# EAGLE board aqc-rev2 (EAGLE 8.3.1), part 1 of 2
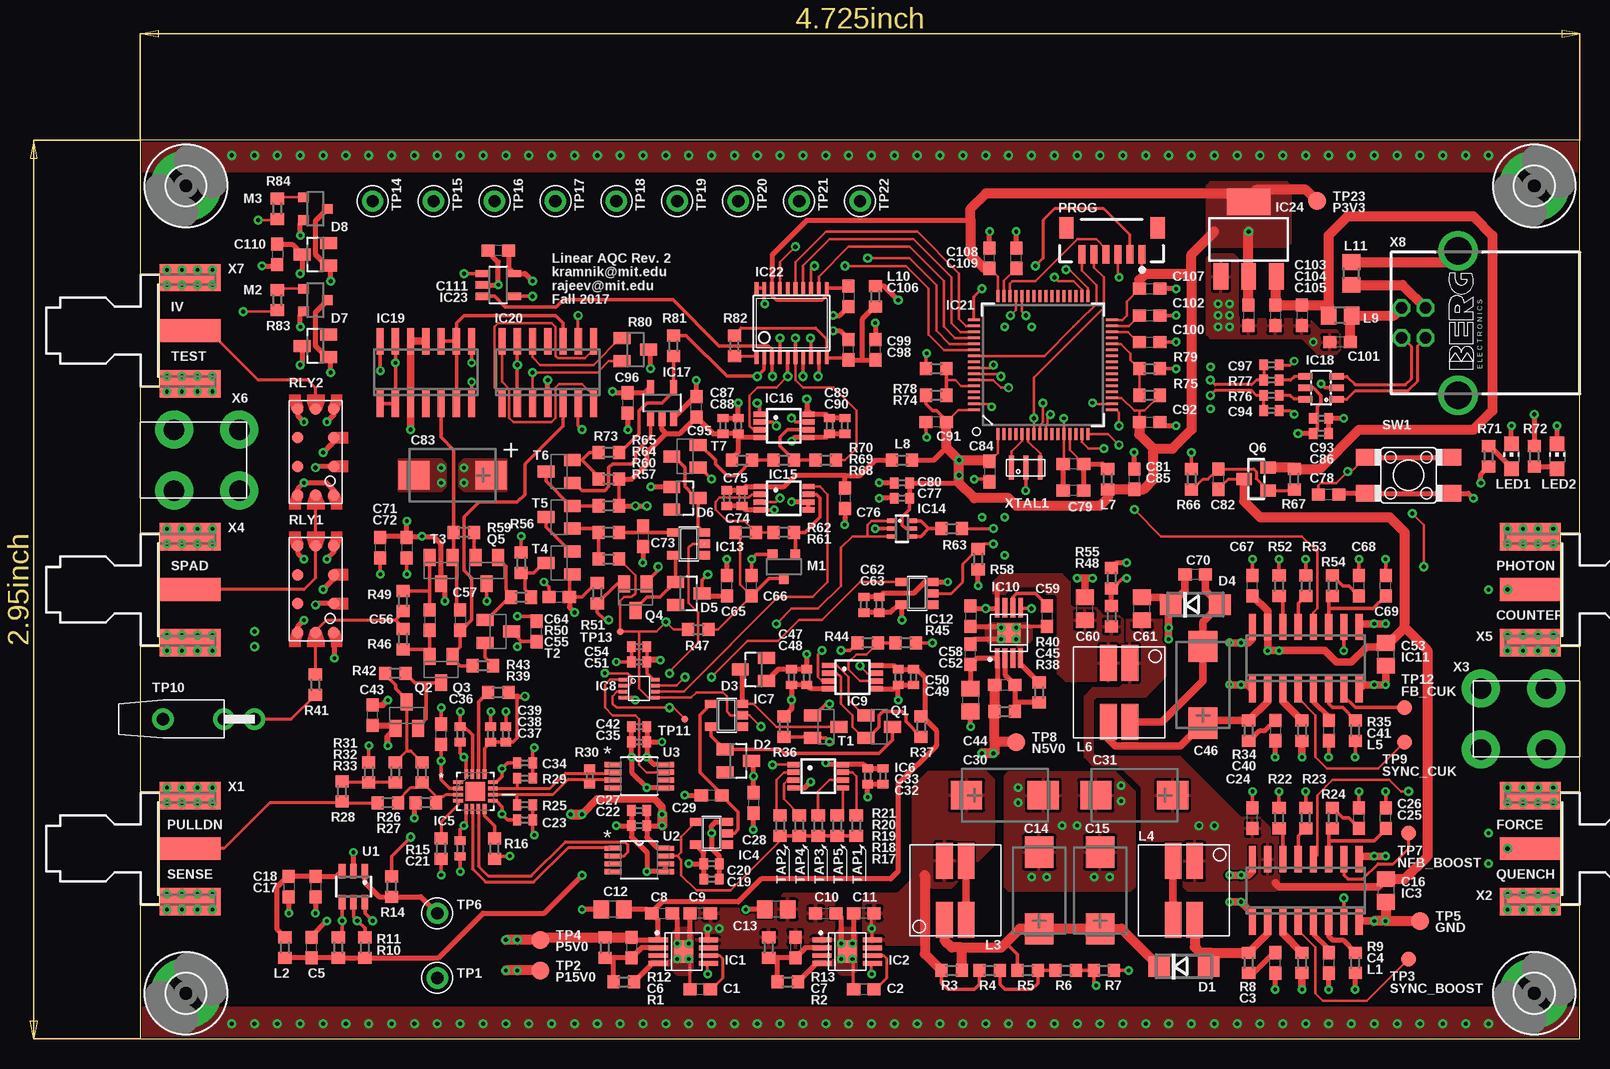
[diagram p12: board, top side]
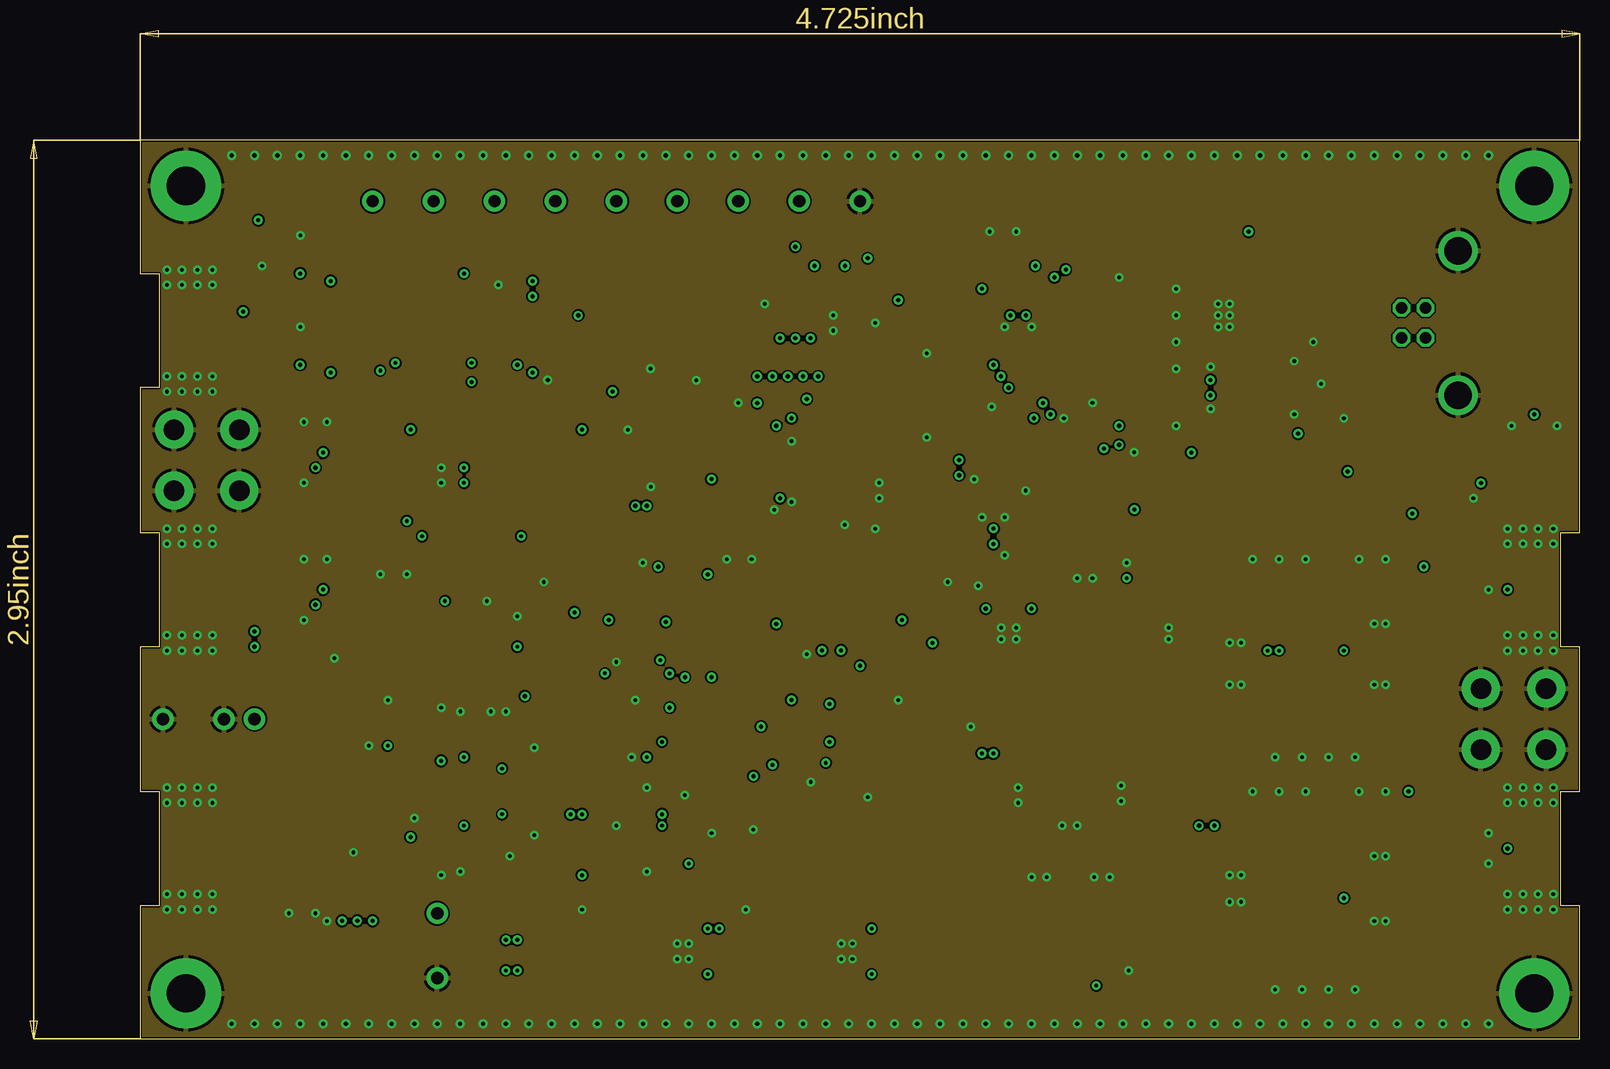
[diagram p13: board, inner layer Route2]
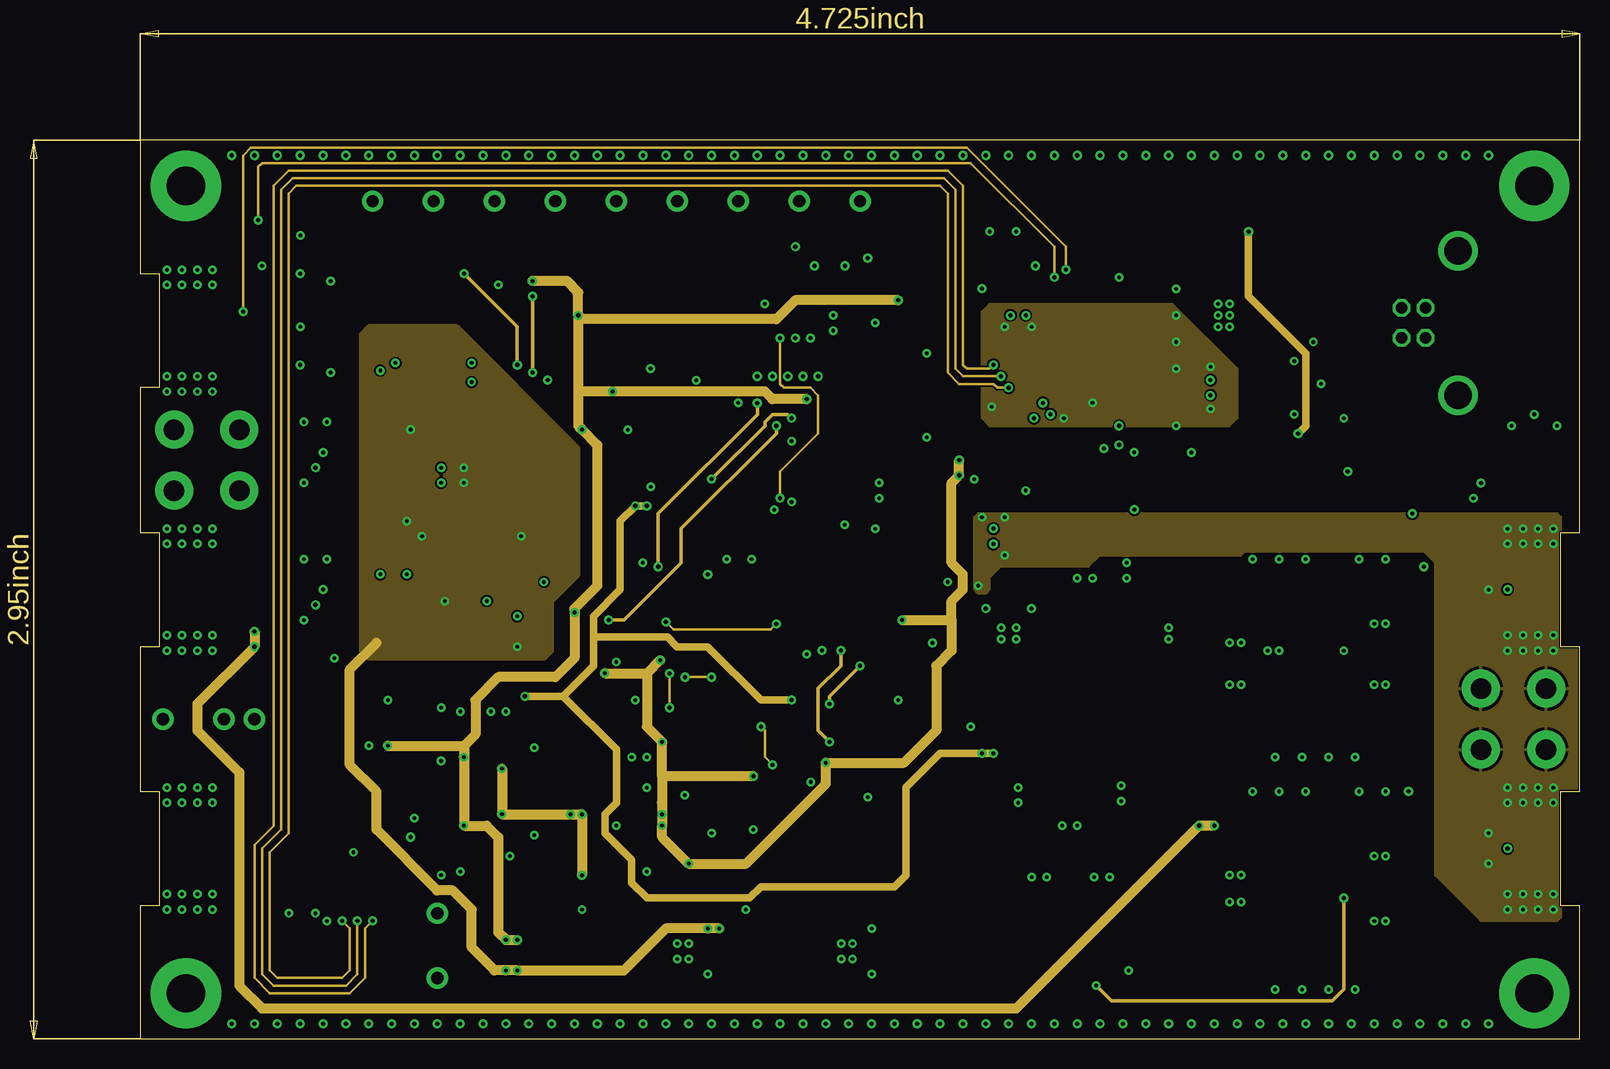
[diagram p14: board, inner layer Route15]
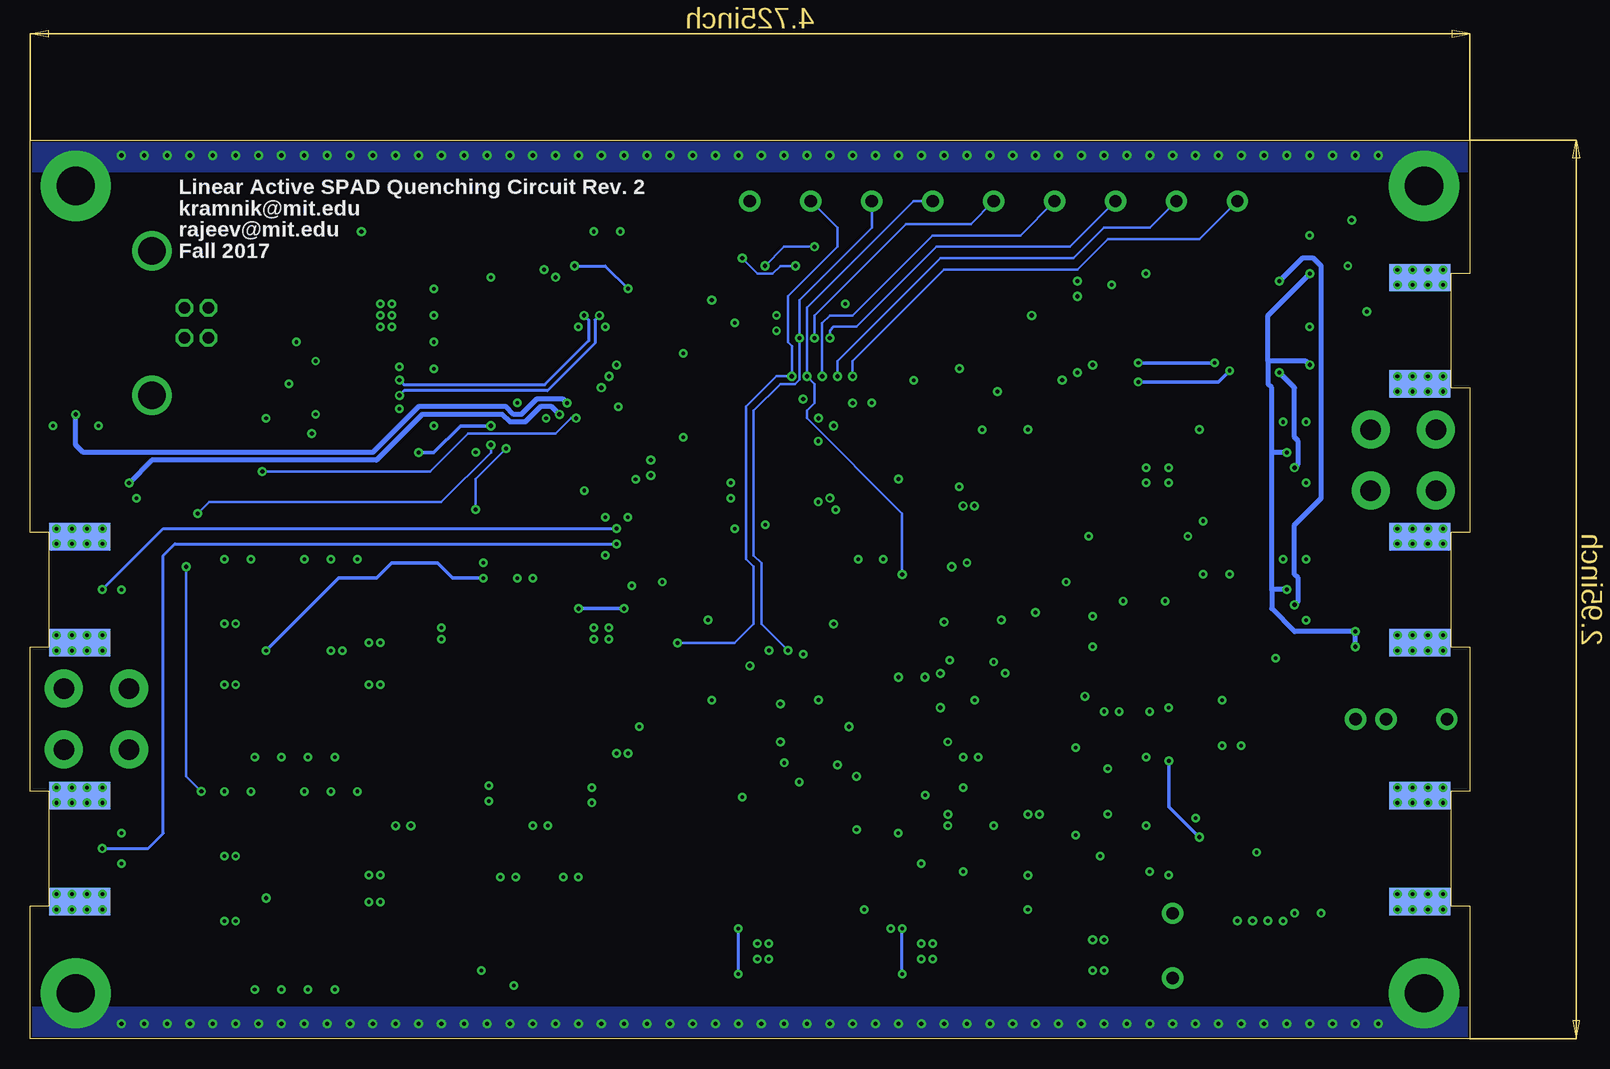
[diagram p15: board, bottom side, seen from below]

Size 120.02 x 74.93 mm. Coordinates in mm from the lower left corner, seen from the top.
Outline: 120.02,74.93 0,74.93 0,63.82 1.59,63.82 1.59,54.29 0,54.29 0,42.23 1.59,42.23 1.59,32.7 0,32.7 0,20.64 1.59,20.64 1.59,11.11 0,11.11 0,0 120.02,0 120.02,11.11 118.43,11.11 118.43,20.64 120.02,20.64 120.02,32.7 118.43,32.7 118.43,42.23 120.02,42.23 120.02,74.93
Copper layers (1+2*15+16): Top 0.035mm / dielectric 1.5mm / Route2 0.035mm / dielectric 0.15mm / Route15 0.035mm / dielectric 0.2mm / Bottom 0.035mm
Design rules "default *": minimum track width 8mil, minimum drill 0.3mm, track to track 6mil, track to pad 6mil, pad to pad 6mil, via to via 6mil, smd to smd 6mil, copper to edge 6mil, drill to drill 6mil, minimum pad ring 10mil, minimum via ring 8mil, stop-mask expansion 4mil, vias tented up to drill 25mil, thermal gap 10mil
Net classes: 1 100OHM_DIFF: width 0.254 mm, clearance 0.254 mm

## Footprints (pad centres in the part's own frame; a part is rotated, then mirrored left to right if it is on the bottom)
C0603 = smd 1.1 x 1: 1 -0.85,0; 2 0.85,0
C0805 = smd 1.3 x 1.5: 1 -0.95,0; 2 0.95,0
CT7343 = smd 2.6 x 2.4: + -3.2,0; - 3.2,0
C0402 = smd 0.7 x 0.9: 1 -0.65,0; 2 0.65,0
DO214AC = smd 1.8 x 1.7: A 2.05,0; C -2.05,0
SOT23 = smd 1 x 1.4: 1 -0.95,-1.1; 2 0.95,-1.1; 3 0,1.1
3,2-PAD = drill 3.2 pad 5.842: B3,2 0,0
MSOP-8_POWER_PAD = smd 0.4 x 1.6: 1 0,0; 2 0.65,0; 3 1.3,0; 4 1.95,0; 5 1.95,4.2; 6 1.3,4.2; 7 0.65,4.2; 8 0,4.2 | smd 1.89 x 1.57: PAD 0.975,2.1
SO16 = smd 0.6 x 2.2: 1 -4.445,-2.6; 2 -3.175,-2.6; 3 -1.905,-2.6; 4 -0.635,-2.6; 5 0.635,-2.6; 6 1.905,-2.6; 7 3.175,-2.6; 8 4.445,-2.6; 9 4.445,2.6; 10 3.175,2.6; 11 1.905,2.6; 12 0.635,2.6; 13 -0.635,2.6; 14 -1.905,2.6; 15 -3.175,2.6; 16 -4.445,2.6
SOT23-5 = smd 0.69 x 0.99: 1 -0.95,-1.29; 2 0,-1.29; 3 0.95,-1.29; 4 0.95,1.3; 5 -0.95,1.3
QFN50P300X300X80-16N = smd 0.813 x 0.305: 1 -1.448,0.762; 2 -1.448,0.254; 3 -1.448,-0.254; 4 -1.448,-0.762; 9 1.448,-0.762; 10 1.448,-0.254; 11 1.448,0.254; 12 1.448,0.762 | smd 0.305 x 0.813: 5 -0.762,-1.448; 6 -0.254,-1.448; 7 0.254,-1.448; 8 0.762,-1.448; 13 0.762,1.448; 14 0.254,1.448; 15 -0.254,1.448; 16 -0.762,1.448 | smd 1.6 x 1.6: 17 0,0
MSOP8 = smd 0.45 x 1: 1 -0.975,-2.05; 2 -0.325,-2.05; 3 0.325,-2.05; 4 0.975,-2.05; 5 0.975,2.05; 6 0.325,2.05; 7 -0.325,2.05; 8 -0.975,2.05
US8_3.1MM_JDEC_MO-187 = smd 0.3 x 0.7: 1 -0.75,-1.35; 2 -0.25,-1.35; 3 0.25,-1.35; 4 0.75,-1.35; 5 0.75,1.35; 6 0.25,1.35; 7 -0.25,1.35; 8 -0.75,1.35
SC70-6L = smd 0.35 x 0.8: 1 -0.65,-0.85; 2 0,-0.85; 3 0.65,-0.85; 4 0.65,0.85; 5 0,0.85; 6 -0.65,0.85
SOT23-5' = smd 0.6 x 1.2: 1 -0.95,-1.306; 2 0,-1.306; 3 0.95,-1.306; 4 0.95,1.306; 5 -0.95,1.306
SOT23-6L = smd 0.55 x 1.2: 1 -0.95,-1.3; 2 0,-1.3; 3 0.95,-1.3; 4 0.95,1.3; 5 0,1.3; 6 -0.95,1.3
SO14 = smd 0.6 x 2.2: 1 -3.81,-2.6; 2 -2.54,-2.6; 3 -1.27,-2.6; 4 0,-2.6; 5 1.27,-2.6; 6 2.54,-2.6; 7 3.81,-2.6; 8 3.81,2.6; 9 2.54,2.6; 10 1.27,2.6; 11 0,2.6; 12 -1.27,2.6; 13 -2.54,2.6; 14 -3.81,2.6
TQFP64_STM32 = smd 0.22 x 1: 1 -3.75,-5.75; 2 -3.25,-5.75; 3 -2.75,-5.75; 4 -2.25,-5.75; 5 -1.75,-5.75; 6 -1.25,-5.75; 7 -0.75,-5.75; 8 -0.25,-5.75; 9 0.25,-5.75; 10 0.75,-5.75; 11 1.25,-5.75; 12 1.75,-5.75; 13 2.25,-5.75; 14 2.75,-5.75; 15 3.25,-5.75; 16 3.75,-5.75; 33 3.75,5.75; 34 3.25,5.75; 35 2.75,5.75; 36 2.25,5.75; 37 1.75,5.75; 38 1.25,5.75; 39 0.75,5.75; 40 0.25,5.75; 41 -0.25,5.75; 42 -0.75,5.75; 43 -1.25,5.75; 44 -1.75,5.75; 45 -2.25,5.75; 46 -2.75,5.75; 47 -3.25,5.75; 48 -3.75,5.75 | smd 1 x 0.22: 17 5.75,-3.75; 18 5.75,-3.25; 19 5.75,-2.75; 20 5.75,-2.25; 21 5.75,-1.75; 22 5.75,-1.25; 23 5.75,-0.75; 24 5.75,-0.25; 25 5.75,0.25; 26 5.75,0.75; 27 5.75,1.25; 28 5.75,1.75; 29 5.75,2.25; 30 5.75,2.75; 31 5.75,3.25; 32 5.75,3.75; 49 -5.75,3.75; 50 -5.75,3.25; 51 -5.75,2.75; 52 -5.75,2.25; 53 -5.75,1.75; 54 -5.75,1.25; 55 -5.75,0.75; 56 -5.75,0.25; 57 -5.75,-0.25; 58 -5.75,-0.75; 59 -5.75,-1.25; 60 -5.75,-1.75; 61 -5.75,-2.25; 62 -5.75,-2.75; 63 -5.75,-3.25; 64 -5.75,-3.75
TSSOP20 = smd 0.305 x 0.991: 1 -2.925,-2.918; 2 -2.275,-2.918; 3 -1.625,-2.918; 4 -0.975,-2.918; 5 -0.325,-2.918; 6 0.325,-2.918; 7 0.975,-2.918; 8 1.625,-2.918; 9 2.275,-2.918; 10 2.925,-2.918; 11 2.925,2.918; 12 2.275,2.918; 13 1.625,2.918; 14 0.975,2.918; 15 0.325,2.918; 16 -0.325,2.918; 17 -0.975,2.918; 18 -1.625,2.918; 19 -2.275,2.918; 20 -2.925,2.918
SOT-223 = smd 1.219 x 2.235: 1 -2.311,-3.099; 2 0,-3.099; 3 2.311,-3.099 | smd 3.6 x 2.2: 4 0,3.099
R0603 = smd 1 x 1.1: 1 -0.85,0; 2 0.85,0
SRF0703 = smd 1.4 x 3: 1 0.9,2.45; 2 -0.9,2.45; 3 -0.9,-2.45; 4 0.9,-2.45
R0805 = smd 1.3 x 1.5: 1 -0.95,0; 2 0.95,0
CHIP-LED0805 = smd 1.2 x 1.2: A 0,-1.05; C 0,1.05
SOT23R_INFINEON = smd 0.8 x 0.9: 1 -0.95,-1; 2 0.95,-1; 3 0,1
JST-6-SMD-VERT-1.0MM = smd 0.6 x 1.55: 1 -2.54,1.27; 2 -1.54,1.27; 3 -0.54,1.27; 4 0.46,1.27; 5 1.46,1.27; 6 2.46,1.27 | smd 1.2 x 1.8: P$1 -3.84,-0.955; P$2 3.76,-0.955
SOT23-BEC = smd 1 x 1.4: B -0.95,-1.1; C 0,1.1; E 0.95,-1.1
SOT23-WIDE = smd 1 x 1.27: 1 -0.95,-1; 2 0.95,-1; 3 0,1
R0402 = smd 0.7 x 0.9: 1 -0.65,0; 2 0.65,0
SOT23C = smd 1 x 1.4: 1 -0.95,-1.1; 2 0.95,-1.1; 3 0,1.1
MEDER_RELAY_CRF = smd 0.95 x 0.95: 1 1.2,0.7; 2 3.6,0.7; 3 6,0.7; 4 8.4,0.7; 5 8.4,2.2; 6 8.4,3.7; 7 6,3.7; 8 3.6,3.7; 9 1.2,3.7; 10 1.2,2.2
E-SWITCH-TL3305AF160QG = smd 1.6 x 1.4: 1 -3.6,-1.5; 2 3.6,-1.5; 3 -3.6,1.5; 4 3.6,1.5
KEYSTONE_5000_MINIATURE = drill 1.016 pad 1.778: P$1 0,0
TP15R = smd 1.5 x 1.5: TP 0,0
B1,27 = smd 1.27 x 1.27: TP 0,0
JOHNSON-129-0701-30X = drill 1.041 pad 1.778: GND1 2.54,0; GND2 7.62,0; SIG 0,0
TP06R = smd 0.6 x 0.6: TP 0,0
SOT23-6 = smd 0.55 x 1.2: 1 -0.95,-1.3; 2 0,-1.3; 3 0.95,-1.3; 4 0.95,1.3; 5 0,1.3; 6 -0.95,1.3
SOP65P490X110-8N = smd 1.422 x 0.432: 1 -2.184,0.965; 2 -2.184,0.33; 3 -2.184,-0.33; 4 -2.184,-0.965; 5 2.184,-0.965; 6 2.184,-0.33; 7 2.184,0.33; 8 2.184,0.965
J502-ND-142-0711-871/876 = smd 5.08 x 1.905: 1 2.565,0 | smd 5.08 x 2.286: G@1 2.565,4.42; G@2 2.565,-4.42 | smd 5.08 x 2.286 bottom: G@3 2.565,4.42; G@4 2.565,-4.42
KEYSTONE-7774 = drill 1.702 pad 3.175: 1 2.819,-2.54; 2 8.255,-2.54; 3 8.255,2.54; 4 2.819,2.54
PN61729-S = drill 0.95 octagon: 1 1.25,4.71; 2 -1.25,4.71; 3 -1.25,2.71; 4 1.25,2.71 | drill 2.3 pad 2.9: S1 -6.02,0; S2 6.02,0
CSTCE_G15L/CSTCE_GH5L = smd 0.4 x 2: 1 -1.2,0; 2 0,0; 3 1.2,0

## Placement (x,y rotation side)
C1  10n  [C0603]  46.67,4.13 180 top
C2  10n  [C0603]  60.33,4.13 180 top
C3  1n  [C0603]  94.61,6.35 90 top
C4  1300p  [C0603]  99.06,6.35 270 top
C5  100n  [C0603]  14.29,7.62 90 top
C6  10n  [C0603]  40.96,7.62 270 top
C7  10n  [C0603]  54.61,7.62 270 top
C8  100n  [C0603]  43.5,10.48 0 top
C9  100n  [C0603]  46.67,10.48 180 top
C10  100n  [C0603]  57.15,10.48 0 top
C11  100n  [C0603]  60.33,10.48 180 top
C12  10u  [C0805]  39.37,10.79 180 top
C13  10u  [C0805]  53.02,10.79 180 top
C14  47u, 20V  [CT7343]  74.93,12.38 90 top
C15  47u, 20V  [CT7343]  80.01,12.38 90 top
C16  4u7  [C0805]  103.82,12.38 270 top
C17  4u7  [C0603]  12.38,12.7 270 top
C18  100n  [C0603]  14.61,12.7 270 top
C19  100n  [C0402]  47.62,13.34 0 top
C20  10n  [C0402]  47.62,14.61 0 top
C21  10n  [C0402]  26.67,15.88 270 top
C22  10n  [C0402]  41.59,17.78 180 top
C23  10n  [C0402]  32.07,18.26 0 top
C24  100n  [C0603]  92.71,18.41 90 top
C25  15n  [C0603]  101.6,18.41 90 top
C26  220p  [C0603]  103.82,18.41 90 top
C27  100n  [C0402]  41.59,19.05 180 top
C28  470p  [C0603]  51.12,19.68 270 top
C29  10p  [C0603]  47.62,20.32 180 top
C30  47u, 20V  [CT7343]  72.07,20.32 0 top
C31  47u, 20V  [CT7343]  82.87,20.32 180 top
C32  100n  [C0402]  60.64,21.91 270 top
C33  10n  [C0402]  61.91,21.91 270 top
C34  100n  [C0402]  32.07,23.02 0 top
C35  100n  [C0402]  41.59,24.77 180 top
C36  1n  [C0603]  25.08,25.4 90 top
C37  100n  [C0402]  26.67,25.4 90 top
C38  100n  [C0402]  29.21,25.4 90 top
C39  10n  [C0402]  30.48,25.4 90 top
C40  10n  [C0603]  94.61,25.72 270 top
C41  1300p  [C0603]  99.06,25.72 270 top
C42  10n  [C0402]  41.59,26.04 180 top
C43  100n  [C0603]  19.37,26.99 90 top
C44  10u  [C0805]  69.22,28.26 270 top
C45  10n  [C0603]  72.07,29.53 0 top
C46  68u, 16V  [CT7343]  88.58,29.53 90 top
C47  10n  [C0402]  54.29,30.16 90 top
C48  100n  [C0402]  55.56,30.16 90 top
C49  10n  [C0402]  63.18,30.16 270 top
C50  100n  [C0402]  64.45,30.16 270 top
C51  10n  [C0402]  41.59,31.43 180 top
C52  100n  [C0603]  69.22,32.07 90 top
C53  4u7  [C0805]  103.82,32.07 270 top
C54  100n  [C0402]  41.59,32.7 180 top
C55  100n  [C0603]  33.02,33.97 90 top
C56  10n  [C0603]  24.13,34.92 270 top
C57  10n  [C0603]  26.67,34.92 270 top
C58  100n  [C0603]  69.22,35.24 270 top
C59  10n  [C0603]  75.56,35.24 270 top
C60  10u, 10V  [C0805]  78.74,35.88 90 top
C61  4u7  [C0805]  83.5,35.88 90 top
C62  10n  [C0402]  60.33,36.2 90 top
C63  100n  [C0402]  61.59,36.2 90 top
C64  100n  [C0603]  34.92,36.83 180 top
C65  470p  [C0603]  48.9,37.78 90 top
C66  470p  [C0603]  50.96,37.78 90 top
C67  100n  [C0603]  92.71,37.78 90 top
C68  33n  [C0603]  101.6,37.78 90 top
C69  DNP  [C0603]  103.82,37.78 90 top
C70  DNP  [C0603]  87.95,38.73 180 top
C71  100n  [C0603]  20,40.96 270 top
C72  10n  [C0603]  22.23,40.96 270 top
C73  10p  [C0603]  41.91,41.91 270 top
C74  10n  [C0402]  48.9,45.09 270 top
C75  100n  [C0402]  50.16,45.09 270 top
C76  4u7  [C0603]  58.74,45.09 270 top
C77  10n  [C0402]  63.5,45.09 180 top
C78  10n  [C0603]  99.06,45.4 0 top
C79  4u7  [C0603]  77.79,45.72 180 top
C80  100n  [C0402]  63.5,46.35 180 top
C81  4u7  [C0603]  82.87,46.67 90 top
C82  100n  [C0603]  89.85,46.67 270 top
C83  47u, 20V  [CT7343]  26.04,46.99 180 top
C84  100n  [C0603]  70.8,47.31 270 top
C85  100n  [C0603]  77.79,47.94 180 top
C86  100n  [C0402]  98.42,50.48 0 top
C87  100n  [C0402]  48.58,51.12 90 top
C88  10n  [C0402]  49.85,51.12 90 top
C89  100n  [C0402]  57.47,51.12 270 top
C90  10n  [C0402]  58.74,51.12 270 top
C91  100n  [C0603]  66.36,51.44 180 top
C92  100n  [C0603]  84.14,51.44 0 top
C93  10n  [C0402]  98.42,51.75 0 top
C94  47p  [C0402]  94.3,52.39 0 top
C95  100n  [C0603]  46.35,52.7 90 top
C96  100n  [C0603]  40.64,53.02 270 top
C97  47p  [C0402]  94.3,56.2 0 top
C98  100n  [C0603]  59.05,57.47 90 top
C99  4u7  [C0603]  61.28,57.47 90 top
C100  100n  [C0603]  84.14,58.1 0 top
C101  10n  [C0603]  100.01,58.1 180 top
C102  100n  [C0603]  84.14,60.33 0 top
C103  100n  [C0603]  92.39,60.33 270 top
C104  100n  [C0603]  94.61,60.33 270 top
C105  4u7  [C0603]  96.84,60.33 270 top
C106  100n  [C0603]  59.05,61.91 270 top
C107  100n  [C0603]  84.14,62.55 0 top
C108  100n  [C0603]  70.8,65.09 90 top
C109  100n  [C0603]  73.03,65.09 90 top
C110  100n  [C0603]  11.43,65.41 270 top
C111  100n  [C0603]  29.84,65.72 180 top
D1  CDBA140SL-HF  [DO214AC]  87,6.03 0 top
D2  BAS40  [SOT23]  49.85,23.18 270 top
D3  BAS40  [SOT23]  51.12,30.8 90 top
D4  CDBA140SL-HF  [DO214AC]  87.95,36.2 0 top
D5  BAS40  [SOT23]  45.72,37.15 270 top
D6  BAS40  [SOT23]  45.4,45.09 270 top
D7  BAS40  [SOT23]  14.61,57.78 90 top
D8  BAS40  [SOT23]  14.61,65.41 90 top
H1  MOUNT-PAD-ROUND3.2  [3,2-PAD]  3.81,3.81 0 top
H2  MOUNT-PAD-ROUND3.2  [3,2-PAD]  116.2,3.81 0 top
H3  MOUNT-PAD-ROUND3.2  [3,2-PAD]  3.81,71.12 0 top
H4  MOUNT-PAD-ROUND3.2  [3,2-PAD]  116.2,71.12 0 top
IC1  TPS7A4901  [MSOP-8_POWER_PAD]  43.18,8.26 270 top
IC2  TPS7A4901  [MSOP-8_POWER_PAD]  56.83,8.26 270 top
IC3  LT1534-1  [SO16]  97.16,12.38 0 top
IC4  74AHC1G04DBV  [SOT23-5]  47.62,17.14 90 top
IC5  ADCMP582  [QFN50P300X300X80-16N]  27.94,20.64 0 top
IC6  DS1100LU-20+  [MSOP8]  56.52,21.91 270 top
IC7  74AHC1G04DBV  [SOT23-5]  48.9,26.99 90 top
IC8  NC7SV74K8X  [US8_3.1MM_JDEC_MO-187]  41.59,29.21 270 top
IC9  TLV272DGK  [MSOP8]  59.37,30.16 270 top
IC10  TPS7A3001  [MSOP-8_POWER_PAD]  71.44,31.75 0 top
IC11  LT1534-1  [SO16]  97.16,31.75 0 top
IC12  74AHC1G04DBV  [SOT23-5]  64.77,37.15 90 top
IC13  74AHC1G04DBV  [SOT23-5]  45.72,41.27 90 top
IC14  NC7WZ16P6X  [SC70-6L]  63.5,42.55 270 top
IC15  LTC1711  [MSOP8]  53.66,45.09 270 top
IC16  TLV272DGK  [MSOP8]  53.66,51.12 270 top
IC17  TLV271DBV  [SOT23-5']  43.5,53.02 0 top
IC18  USBLC6-2SC6Y  [SOT23-6L]  98.42,54.29 90 top
IC19  ALD1107  [SO14]  23.81,55.56 0 top
IC20  ALD1106  [SO14]  33.97,55.56 0 top
IC21  STM32F411RE  [TQFP64_STM32]  75.25,56.2 0 top
IC22  MAX572X  [TSSOP20]  54.29,59.69 0 top
IC23  TLV271DBV  [SOT23-5']  29.84,62.87 270 top
IC24  LM1117  [SOT-223]  92.39,66.67 0 top
L1  25n  [R0603]  96.84,6.35 270 top
L2  PE-0603FB601ST  [R0603]  12.06,7.62 90 top
L3  SRF0703-820M  [SRF0703]  67.94,12.38 180 top
L4  SRF0703-820M  [SRF0703]  87,12.38 0 top
L5  25n  [R0603]  96.84,25.72 270 top
L6  SRF0703-820M  [SRF0703]  81.6,28.89 0 top
L7  PE-0603FB601ST  [R0603]  80.64,46.67 90 top
L8  PE-0603FB601ST  [R0603]  63.5,48.26 180 top
L9  MI0805J102R-10  [R0805]  100.01,60.33 180 top
L10  PE-0603FB601ST  [R0603]  61.28,61.91 270 top
L11  MI0805J102R-10  [R0805]  100.97,63.82 90 top
LED1  [CHIP-LED0805]  114.3,48.58 0 top
LED2  [CHIP-LED0805]  118.11,48.58 0 top
M1  BSS806N  [SOT23R_INFINEON]  53.66,39.37 180 top
M2  BSS806N  [SOT23R_INFINEON]  14.61,61.59 270 top
M3  BSS806N  [SOT23R_INFINEON]  14.61,69.22 270 top
PROG  JST_VERT  [JST-6-SMD-VERT-1.0MM]  80.96,66.67 180 top
Q1  MMBTH81  [SOT23-BEC]  61.59,26.04 270 top
Q2  MMBTH81  [SOT23-BEC]  22.23,26.99 0 top
Q3  MMBTH81  [SOT23-BEC]  25.08,30.8 180 top
Q4  MMBTH81  [SOT23-BEC]  41.27,36.83 180 top
Q5  MMBTH81  [SOT23-BEC]  28.89,39.05 180 top
Q6  IRLML6402TRPBF  [SOT23-WIDE]  93.03,46.67 90 top
R1  24k  [R0603]  40.32,4.76 0 top
R2  11k8  [R0603]  53.98,4.76 0 top
R3  DNP  [R0603]  67.63,5.71 180 top
R4  0R  [R0603]  70.8,5.71 0 top
R5  DNP  [R0603]  73.98,5.71 0 top
R6  29k4  [R0603]  77.15,5.71 180 top
R7  2k49  [R0603]  80.33,5.71 0 top
R8  10R  [R0603]  92.39,6.35 270 top
R9  16k9  [R0603]  101.28,6.35 90 top
R10  2k2  [R0603]  16.51,7.62 90 top
R11  2k2  [R0603]  18.73,7.62 90 top
R12  76k8  [R0603]  38.73,7.62 90 top
R13  137k  [R0603]  52.39,7.62 90 top
R14  100R  [R0603]  20.95,12.7 270 top
R15  DNP  [R0603]  25.08,15.88 90 top
R16  49R9  [R0603]  29.53,15.88 270 top
R17  DNP  [R0603]  53.34,17.78 90 top
R18  DNP  [R0603]  54.93,17.78 90 top
R19  DNP  [R0603]  56.52,17.78 90 top
R20  DNP  [R0603]  58.1,17.78 90 top
R21  DNP  [R0603]  59.69,17.78 90 top
R22  1k  [R0603]  94.93,18.41 90 top
R23  1k  [R0603]  97.16,18.41 90 top
R24  6k8  [R0603]  99.38,18.41 270 top
R25  150R  [R0402]  32.07,19.53 0 top
R26  DNP  [R0603]  20.64,19.68 0 top
R27  DNP  [R0603]  23.81,19.68 0 top
R28  0R  [R0603]  16.83,20.64 90 top
R29  150R  [R0402]  32.07,21.75 0 top
R30  100R  [R0402]  37.47,21.91 90 top
R31  DNP  [R0603]  19.05,22.23 270 top
R32  1k  [R0603]  21.27,22.23 90 top
R33  0R  [R0603]  23.5,22.23 90 top
R34  100R  [R0603]  92.39,25.72 270 top
R35  16k9  [R0603]  101.28,25.72 90 top
R36  470R  [R0603]  53.66,26.04 270 top
R37  470R  [R0603]  65.09,26.04 90 top
R38  76k8  [R0603]  72.07,27.3 180 top
R39  10k  [R0603]  29.84,28.89 180 top
R40  24k  [R0603]  74.93,28.89 90 top
R41  49R9  [R0603]  14.61,29.53 270 top
R42  DNP  [R0603]  21.27,30.48 0 top
R43  200R  [R0603]  28.57,31.11 0 top
R44  100k  [R0603]  60.64,33.02 0 top
R45  100k  [R0603]  63.82,33.02 0 top
R46  100R  [R0603]  21.91,33.34 90 top
R47  1k  [R0603]  46.51,34.13 180 top
R48  1k4  [R0603]  80.96,35.24 90 top
R49  100R  [R0603]  21.91,36.51 90 top
R50  49R9  [R0603]  31.75,36.83 0 top
R51  470R  [R0603]  38.1,37.15 90 top
R52  1k  [R0603]  94.93,37.78 90 top
R53  1k  [R0603]  97.16,37.78 90 top
R54  2k  [R0603]  99.38,37.78 270 top
R55  1k  [R0603]  80.96,38.42 90 top
R56  220R  [R0603]  31.75,39.69 90 top
R57  DNP  [R0603]  39.05,40.01 0 top
R58  49R9  [R0603]  69.85,40.01 90 top
R59  200R  [R0603]  26.99,42.23 180 top
R60  0R  [R0603]  39.05,42.23 0 top
R61  1k  [R0603]  50.48,42.23 180 top
R62  10k  [R0603]  53.66,42.23 180 top
R63  49R9  [R0603]  67.63,42.55 180 top
R64  470R  [R0603]  39.05,44.45 180 top
R65  220R  [R0603]  39.05,46.67 180 top
R66  4k7  [R0603]  87.63,46.67 90 top
R67  100k  [R0603]  96.2,46.67 90 top
R68  470R  [R0603]  50.16,48.26 0 top
R69  100k  [R0603]  53.66,48.26 0 top
R70  100k  [R0603]  57.15,48.26 0 top
R71  470R  [R0603]  112.39,48.58 270 top
R72  470R  [R0603]  116.2,48.58 90 top
R73  100k  [R0603]  39.05,48.9 0 top
R74  DNP  [R0603]  66.36,53.66 0 top
R75  DNP  [R0603]  84.14,53.66 180 top
R76  22R  [R0402]  94.3,53.66 0 top
R77  22R  [R0402]  94.3,54.93 0 top
R78  0R  [R0603]  66.36,55.88 180 top
R79  DNP  [R0603]  84.14,55.88 0 top
R80  SOT-DIV23LF-03-1001-1001-BB  [SOT23C]  41.27,57.47 270 top
R81  100k  [R0603]  44.45,57.78 90 top
R82  0R  [R0603]  49.53,57.78 270 top
R83  100R  [R0603]  11.43,61.59 270 top
R84  100R  [R0603]  11.43,69.22 270 top
RLY1  CRF05-1A  [MEDER_RELAY_CRF]  16.83,32.7 90 top
RLY2  CRF05-1A  [MEDER_RELAY_CRF]  16.83,44.13 90 top
SW1  MCU_RST  [E-SWITCH-TL3305AF160QG]  105.73,46.99 0 top
T1  MMBTH10  [SOT23-BEC]  57.15,26.04 270 top
T2  MMBTH10  [SOT23-BEC]  29.84,33.97 270 top
T3  MMBTH10  [SOT23-BEC]  25.08,39.05 180 top
T4  MMBTH10  [SOT23-BEC]  34.92,39.69 90 top
T5  MMBTH10  [SOT23-BEC]  34.92,43.5 90 top
T6  MMBTH10  [SOT23-BEC]  34.92,47.31 90 top
T7  MMBTH10  [SOT23-BEC]  45.4,48.58 90 top
TP1  GND  [KEYSTONE_5000_MINIATURE]  24.77,5.08 270 top
TP2  TPTP15R  [TP15R]  33.34,5.71 0 top
TP3  TPB1,27  [B1,27]  105.73,6.67 0 top
TP4  TPTP15R  [TP15R]  33.34,8.26 0 top
TP5  TPTP15R  [TP15R]  106.68,9.84 0 top
TP6  VREF_AV_DET  [KEYSTONE_5000_MINIATURE]  24.77,10.48 0 top
TP7  TPB1,27  [B1,27]  105.73,17.14 0 top
TP8  TPTP15R  [TP15R]  73.03,24.77 0 top
TP9  TPB1,27  [B1,27]  105.41,24.77 0 top
TP10  TP_VSCOPE  [JOHNSON-129-0701-30X]  9.53,26.67 180 top
TP11  TPTP06R  [TP06R]  45.4,26.67 0 top
TP12  TPB1,27  [B1,27]  105.41,27.62 0 top
TP13  TPTP06R  [TP06R]  40.01,33.97 0 top
TP14  CASC_IBIAS  [KEYSTONE_5000_MINIATURE]  19.37,69.85 0 top
TP15  DMND_IBIAS  [KEYSTONE_5000_MINIATURE]  24.45,69.85 0 top
TP16  ONE_SHOT  [KEYSTONE_5000_MINIATURE]  29.53,69.85 0 top
TP17  SLEW_UP  [KEYSTONE_5000_MINIATURE]  34.61,69.85 270 top
TP18  SLEW_DN  [KEYSTONE_5000_MINIATURE]  39.69,69.85 270 top
TP19  SLEW_MAX  [KEYSTONE_5000_MINIATURE]  44.77,69.85 270 top
TP20  DELAY_UP  [KEYSTONE_5000_MINIATURE]  49.85,69.85 270 top
TP21  DELAY_DN  [KEYSTONE_5000_MINIATURE]  54.93,69.85 270 top
TP22  GND  [KEYSTONE_5000_MINIATURE]  60.01,69.85 90 top
TP23  TPTP15R  [TP15R]  98.11,69.85 0 top
U1  MCP4725  [SOT23-6]  17.78,12.7 180 top
U2  SN65EPT22DGK  [SOP65P490X110-8N]  41.59,14.92 0 top
U3  SN65EPT21DGK  [SOP65P490X110-8N]  41.59,21.91 0 top
X1  CONN_PULLDN_SENSE  [J502-ND-142-0711-871/876]  1.59,15.88 0 top
X2  CONN_FORCE_QUENCH  [J502-ND-142-0711-871/876]  118.43,15.88 180 top
X3  KEYSTONE-7774  [KEYSTONE-7774]  120.02,26.67 180 top
X4  CONN_SPAD  [J502-ND-142-0711-871/876]  1.59,37.47 0 top
X5  CONN_PHOTON_COUNTER  [J502-ND-142-0711-871/876]  118.43,37.47 180 top
X6  KEYSTONE-7774  [KEYSTONE-7774]  0,48.26 0 top
X7  CONN_SMU  [J502-ND-142-0711-871/876]  1.59,59.05 0 top
X8  PN61729-S  [PN61729-S]  109.86,59.69 90 top
XTAL1  CSTCE8M00G15L99-R0  [CSTCE_G15L/CSTCE_GH5L]  73.82,47.62 0 top